# Altium schematic sheet bmsMaster_power.SchDoc
size A; SheetNumber: 3; SheetTotal: 7
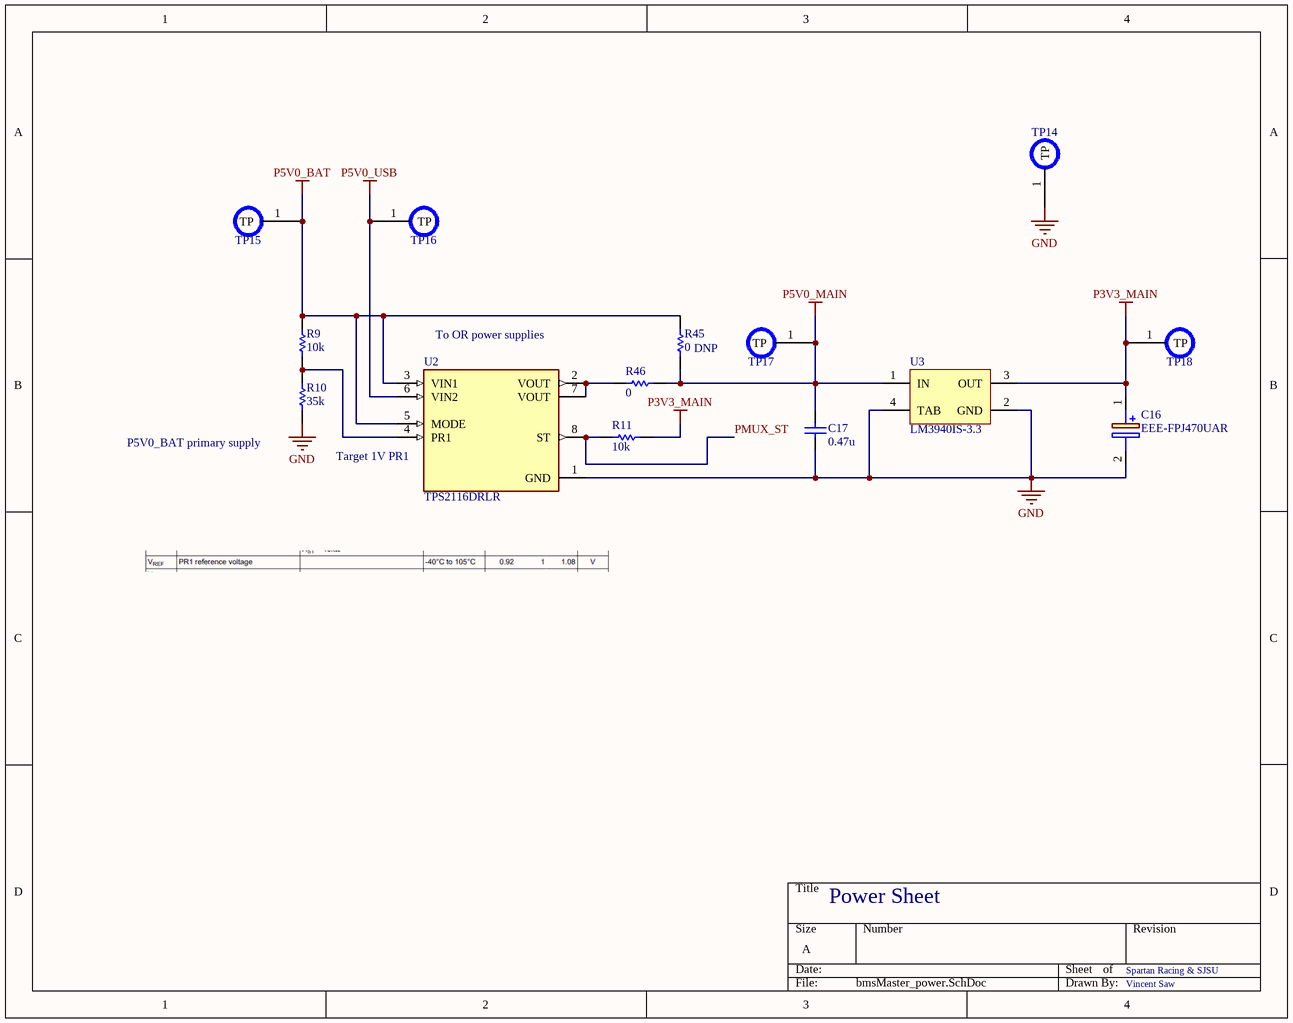
[diagram p0: bmsMaster_power.SchDoc]

## Parts
C16  EEE-FPJ470UAR  [EEE1AA220WR]
C17  value 0.47u  [CAPC1608X90N]  (hidden comment: Capacitor)
R9  value 10k  [RESC1608X50N]  (hidden comment: Resistor)
R10  value 35k  [RESC1608X50N]  (hidden comment: Resistor)
R11  value 10k  [RESC1608X50N]  (hidden comment: Resistor)
R45  value 0  [RESC1608X50N]  (hidden comment: Resistor)
R46  value 0  [RESC1608X50N]  (hidden comment: Resistor)
TP14  TSTPT  [Testpoint1]  (value not drawn)  (no BOM)
TP15  TSTPT  [Testpoint1]  (value not drawn)  (no BOM)
TP16  TSTPT  [Testpoint1]  (value not drawn)  (no BOM)
TP17  TSTPT  [Testpoint1]  (value not drawn)  (no BOM)
TP18  TSTPT  [Testpoint1]  (value not drawn)  (no BOM)
U2  TPS2116DRLR  [SOTFL50P160X60-8N]
U3  LM3940IS-3.3  [KTT0003B_N]

## Nets
GND: C16.2(-) C17.1 R10.1 TP14.1(TP) U2.1(GND) U3.2(GND) U3.4(TAB)
P3V3_MAIN: C16.1(+) R11.1 TP18.1(TP) U3.3(OUT)
P5V0_BAT: R9.2 R45.2 TP15.1(TP) U2.3(VIN1) U2.5(MODE)
P5V0_MAIN: C17.2 R45.1 R46.2 TP17.1(TP) U3.1(IN)
P5V0_USB: TP16.1(TP) U2.6(VIN2)
PMUX_ST: R11.2 U2.8(ST)
NetR9_1: R9.1 R10.2 U2.4(PR1)
NetR46_1: R46.1 U2.2(VOUT) U2.7(VOUT)

## Notes on the sheet
- (near U2) To OR power supplies
- (near R45) DNP
- (near R10) P5V0_BAT primary supply
- (near U2) Target 1V PR1
- Power Sheet
- Spartan Racing & SJSU
- Vincent Saw

## Library data of the parts
C16 = EEE-FPJ470UAR: Capacitor Polarised; Manufacturer_Name: Panasonic; Datasheet Link: http://industrial.panasonic.com/cdbs/www-data/pdf/RDE0000/ABA0000C1184.pdf; Height: 5.5mm; Manufacturer_Part_Number: EEE-FPJ470UAR; Mouser Part Number: 667-EEE-FPJ470UAR; Mouser Price/Stock: https://www.mouser.com/Search/Refine.aspx?Keyword=667-EEE-FPJ470UAR
C17 = Capacitor: SimulationGenericComponent: True
R9-R11 = Resistor: TC1: 0; SimulationGenericComponent: True; TC2: 0
R45 R46 = Resistor: SimulationGenericComponent: True; TC1: 0; TC2: 0
TP14-TP18 = Testpoint1
U2 = TPS2116DRLR: 1.6 V to 5.5 V, 2.5-A Low IQ Power Mux with Manual and Priority Switchover; MF: {'manufacturer': u'Texas Instruments'}; Value: *; Price: None; Package: None; Availability: Unavailable; MP: TPS2116DRLR
U3 = CMP-0062-00201-4: 1A Low Dropout Regulator for 5V to 3.3V Conversion, 3-pin TO-263; Manufacturer: Texas Instruments; CompType: LDO IC; PowerWise: N; PackageTopMarking: NSUZXYTTE#*LM3940IS*-3.3 P+; PinCount: 3; Code_JEDEC: MO-169-AA; PackageReference: KTT0003B; ComponentLink1URL: http://www.ti.com/general/docs/lit/getliterature.tsp?genericPartNumber=LM3940&fileType=pdf; RoHS: N; PackageDescription: TO-263, Molded, .400 x .390 x .180in, 3 Lead, .1in Pitch, Surface Mount; ComponentLink1Description: Datasheet URL